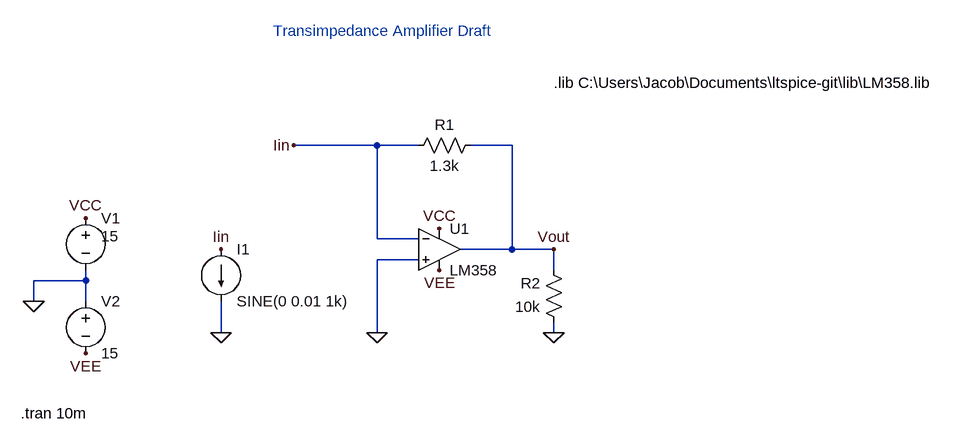
[diagram p0: schematic trans_impedance_op.asc]
trans_impedance_op.asc, the LTspice schematic file:
Version 4
SHEET 1 1116 680
WIRE 176 224 48 224
WIRE 240 224 176 224
WIRE 384 224 320 224
WIRE 176 368 176 224
WIRE 240 368 176 368
WIRE 384 384 384 224
WIRE 384 384 304 384
WIRE 448 384 384 384
WIRE 240 400 176 400
WIRE 448 416 448 384
WIRE -272 432 -272 416
WIRE -272 432 -352 432
WIRE -352 464 -352 432
WIRE -272 464 -272 432
WIRE -64 512 -64 464
WIRE 176 512 176 400
WIRE 448 512 448 496
FLAG 272 352 VCC
FLAG 272 416 VEE
FLAG 176 512 0
FLAG 448 384 Vout
FLAG 448 512 0
FLAG -352 464 0
FLAG -272 544 VEE
FLAG -272 336 VCC
FLAG -64 512 0
FLAG -64 384 Iin
FLAG 48 224 Iin
SYMBOL OpAmps\\opamp2 272 320 R0
SYMATTR InstName U1
SYMATTR Value LM358
SYMBOL res 336 208 R90
WINDOW 0 0 56 VBottom 2
WINDOW 3 32 56 VTop 2
SYMATTR InstName R1
SYMATTR Value 1.3k
SYMBOL res 464 512 R180
WINDOW 0 36 76 Left 2
WINDOW 3 36 40 Left 2
SYMATTR InstName R2
SYMATTR Value 10k
SYMBOL voltage -272 320 R0
WINDOW 3 24 44 Left 2
WINDOW 123 0 0 Left 0
WINDOW 39 0 0 Left 0
SYMATTR InstName V1
SYMATTR Value 15
SYMBOL voltage -272 448 R0
WINDOW 123 0 0 Left 0
WINDOW 39 0 0 Left 0
SYMATTR InstName V2
SYMATTR Value 15
SYMBOL current -64 384 R0
WINDOW 123 0 0 Left 0
WINDOW 39 0 0 Left 0
SYMATTR InstName I1
SYMATTR Value SINE(0 0.01 1k)
TEXT 16 48 Left 2 ;Transimpedance Amplifier Draft
TEXT 448 128 Left 2 !.lib C:\\Users\\Jacob\\Documents\\ltspice-git\\lib\\LM358.lib
TEXT -372 636 Left 2 !.tran 10m

The netlist it stands for:
* trans_impedance_op.asc
XU1 0 Iin VCC VEE Vout LM358  ; pins In+ In- V+ V- OUT
R1 Vout Iin 1.3k
R2 0 Vout 10k
V1 VCC 0 15
V2 0 VEE 15
I1 Iin 0 SINE(0 0.01 1k)
* Transimpedance Amplifier Draft
.lib C:\Users\Jacob\Documents\ltspice-git\lib\LM358.lib
.tran 10m
.backanno
.end